# Altium project Volta-Interface.PrjPcb
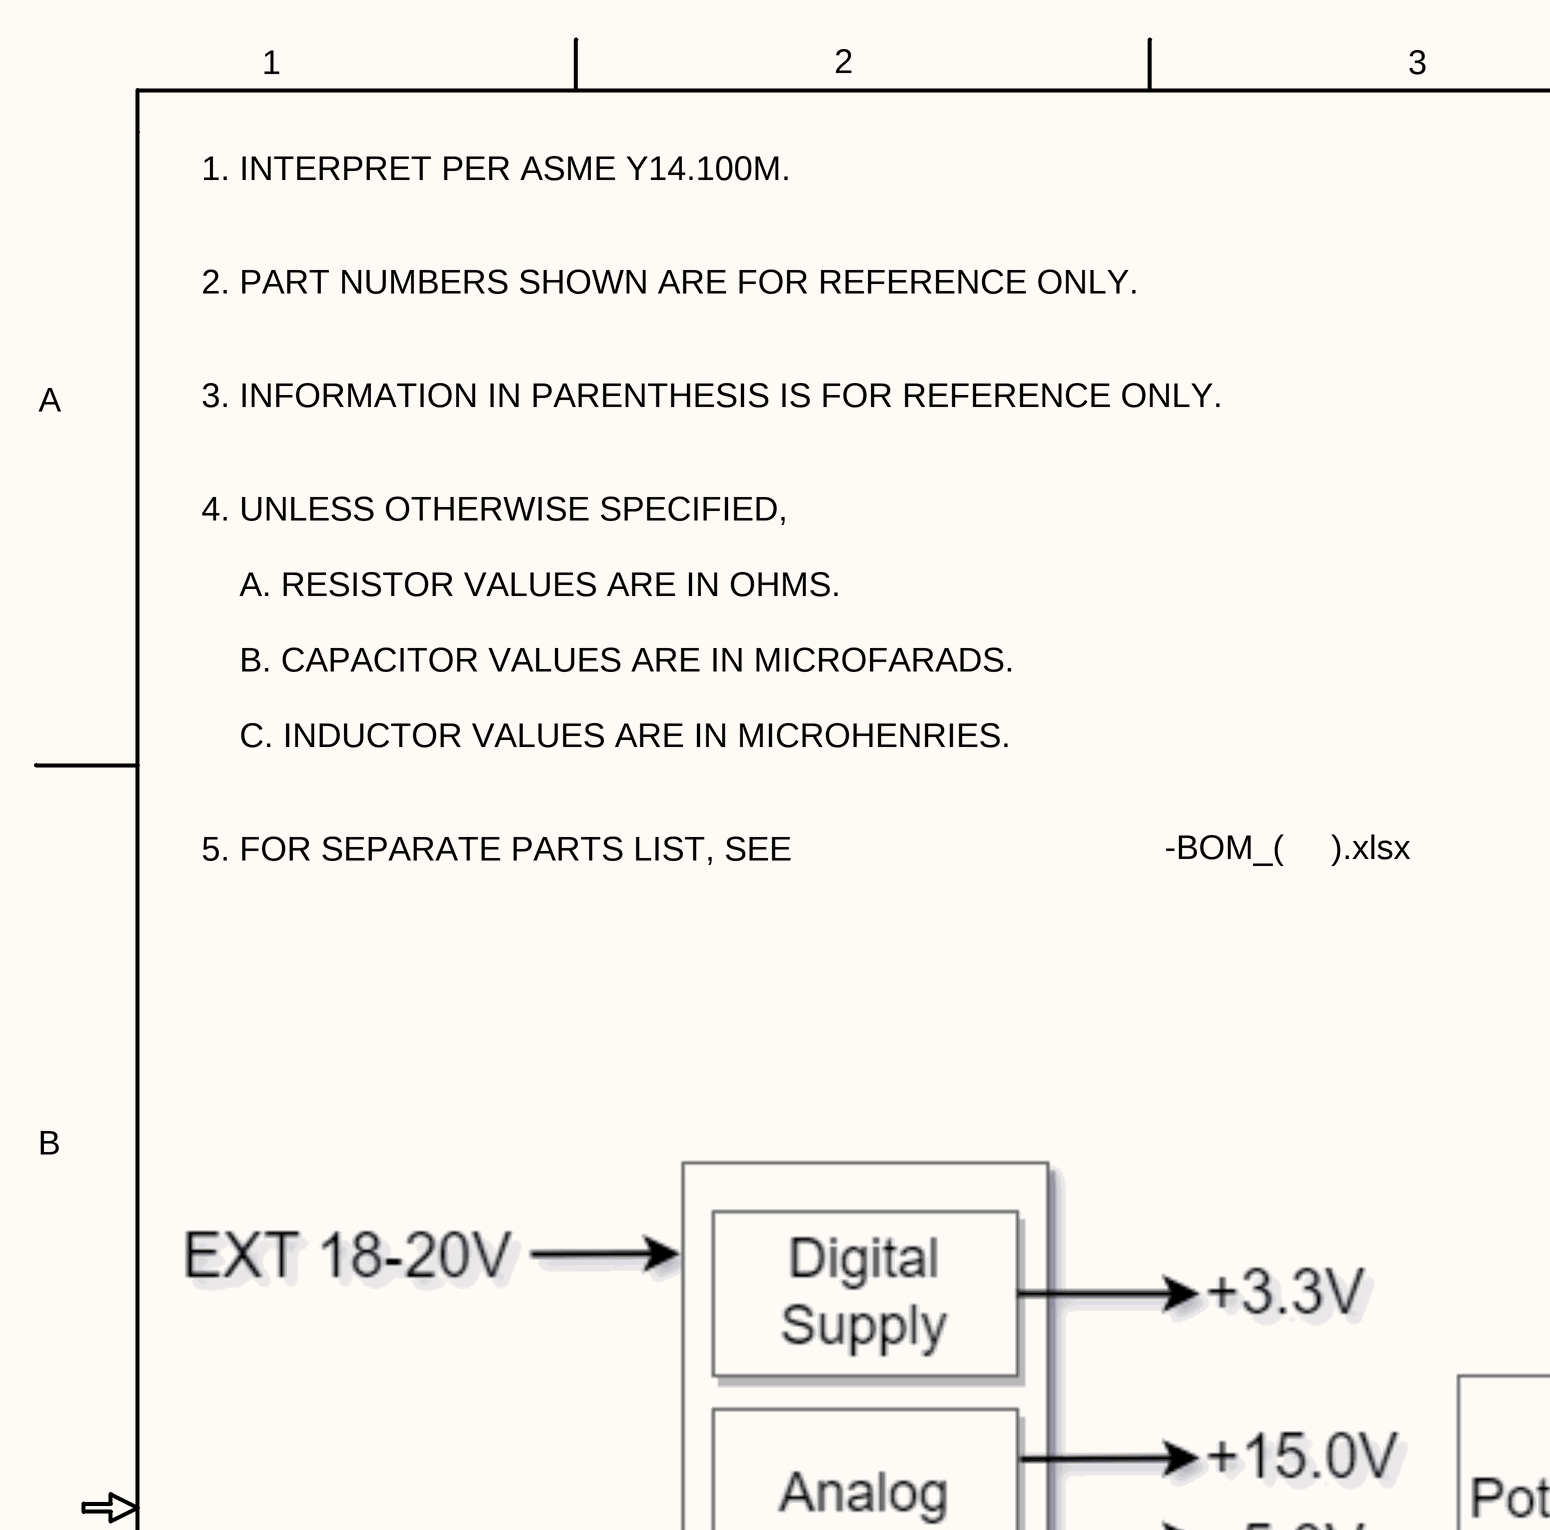
[diagram p0: Volta-Interface-SCH_SH1_(A).SchDoc, top left]
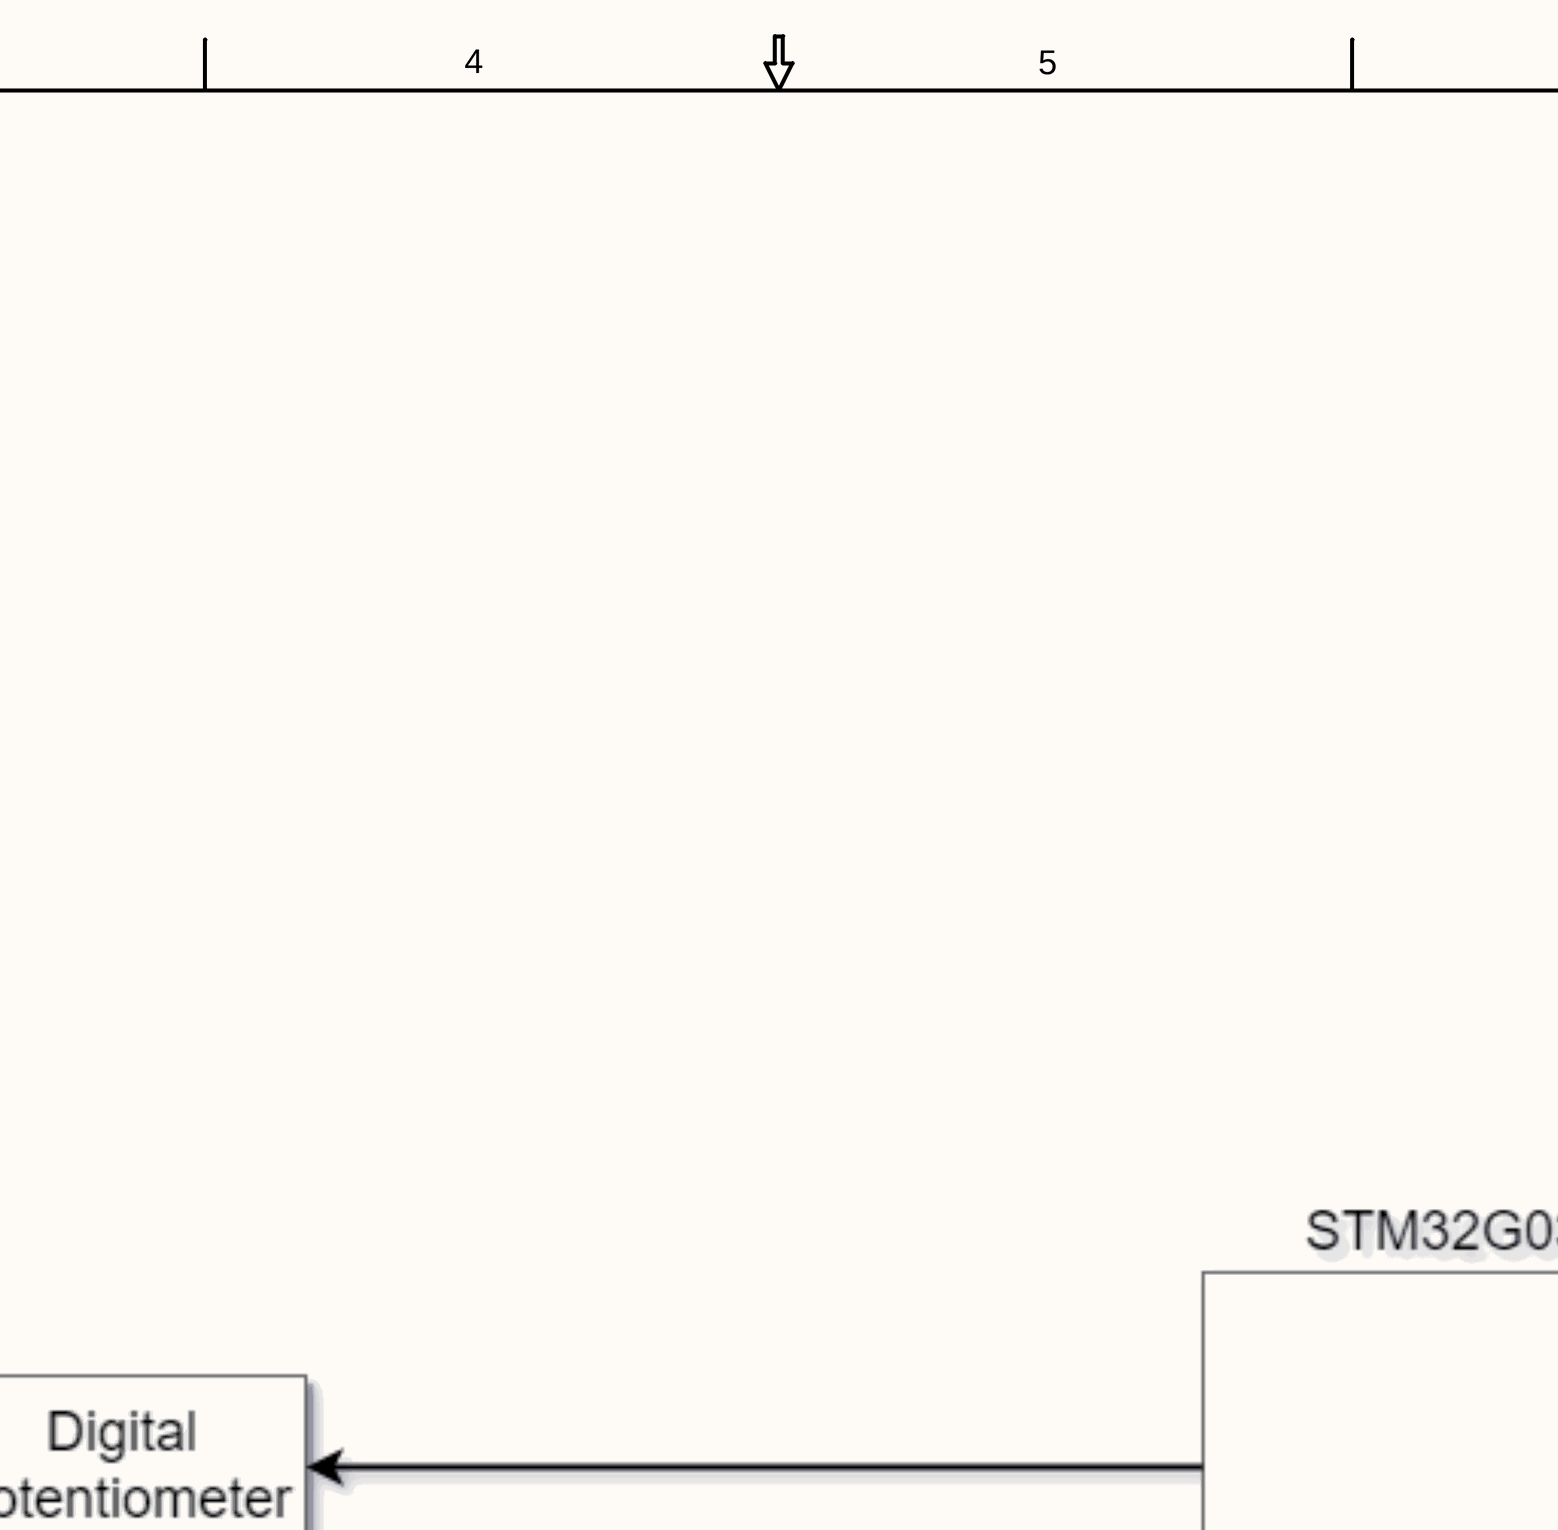
[diagram p1: Volta-Interface-SCH_SH1_(A).SchDoc, top middle]
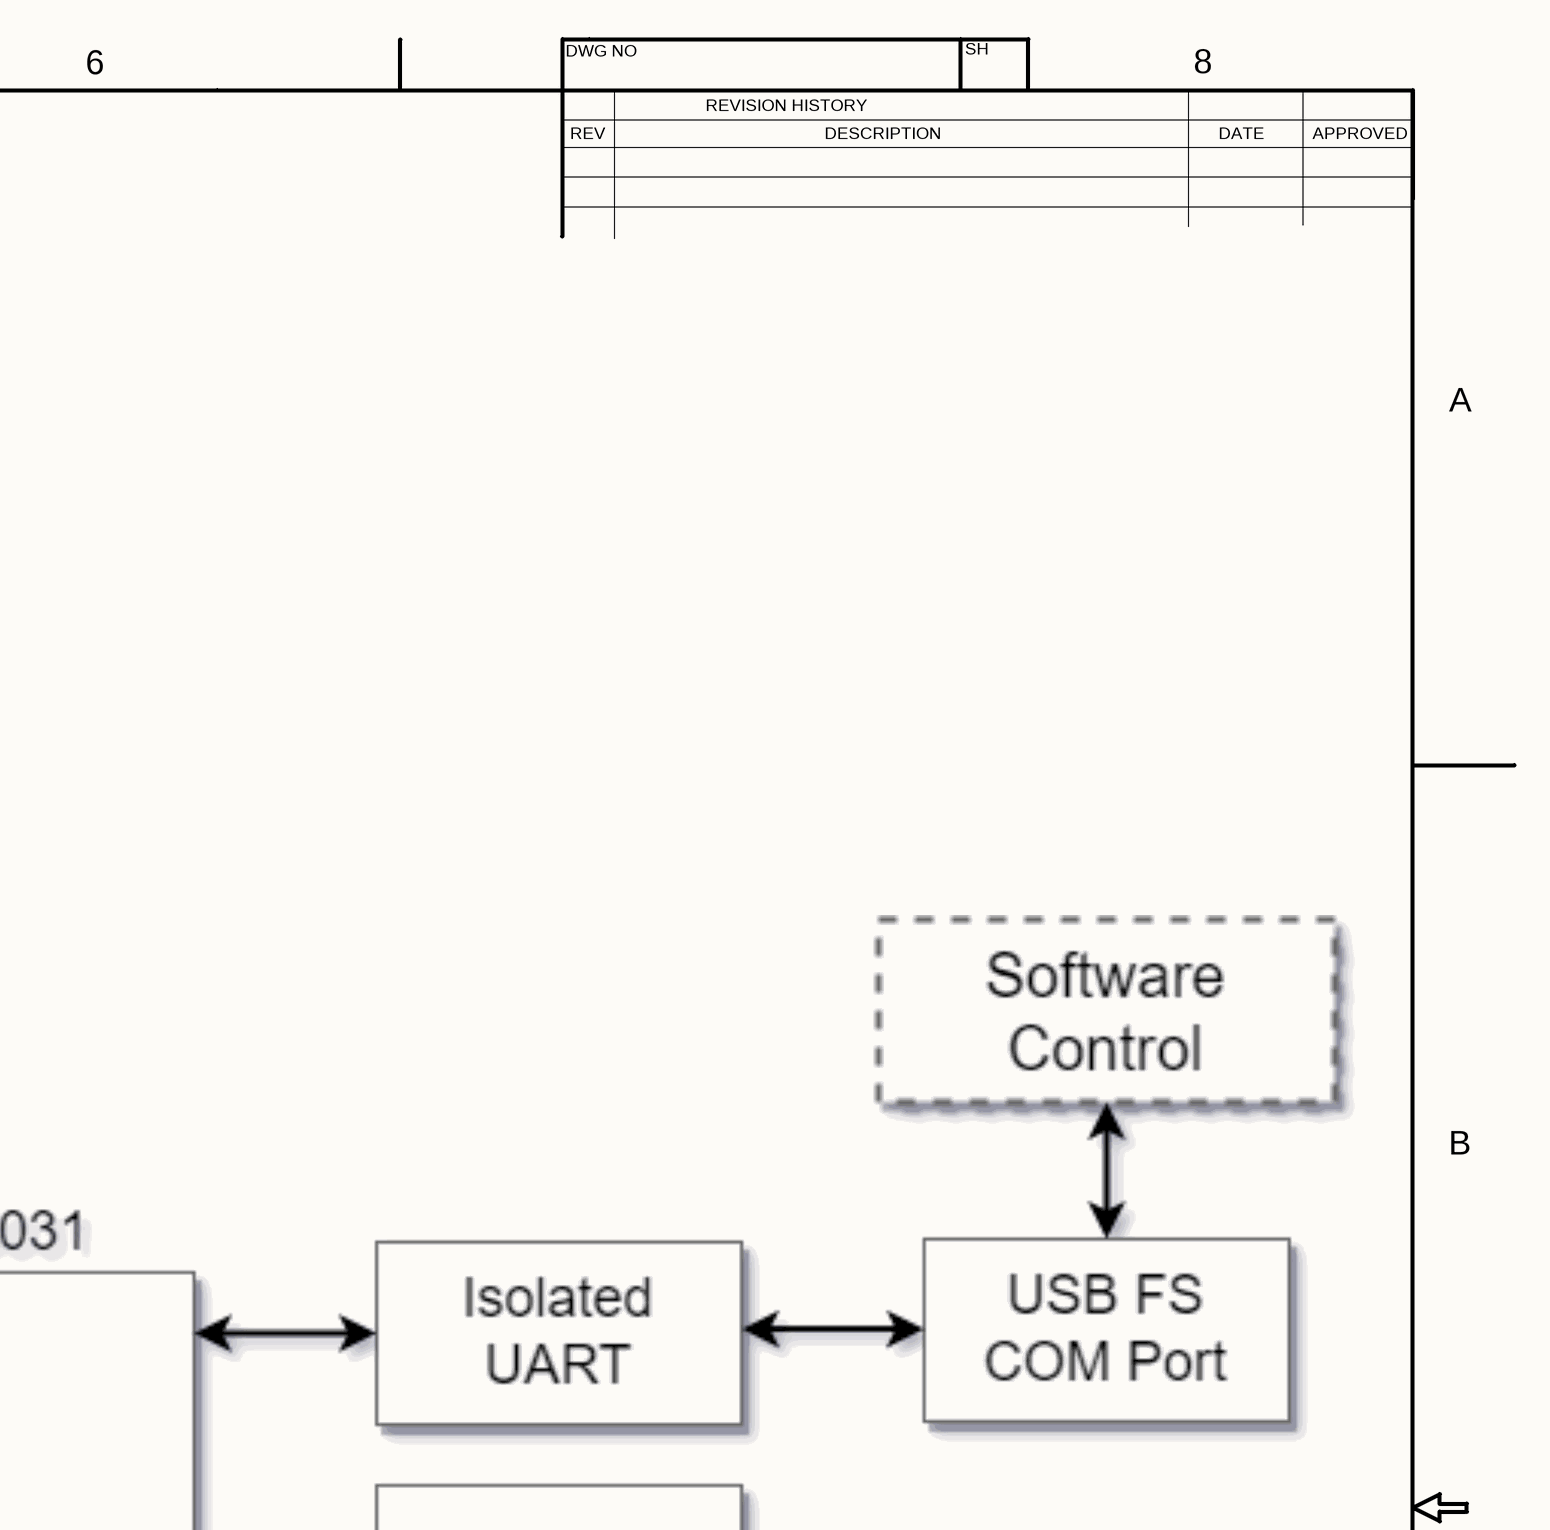
[diagram p2: Volta-Interface-SCH_SH1_(A).SchDoc, top right]
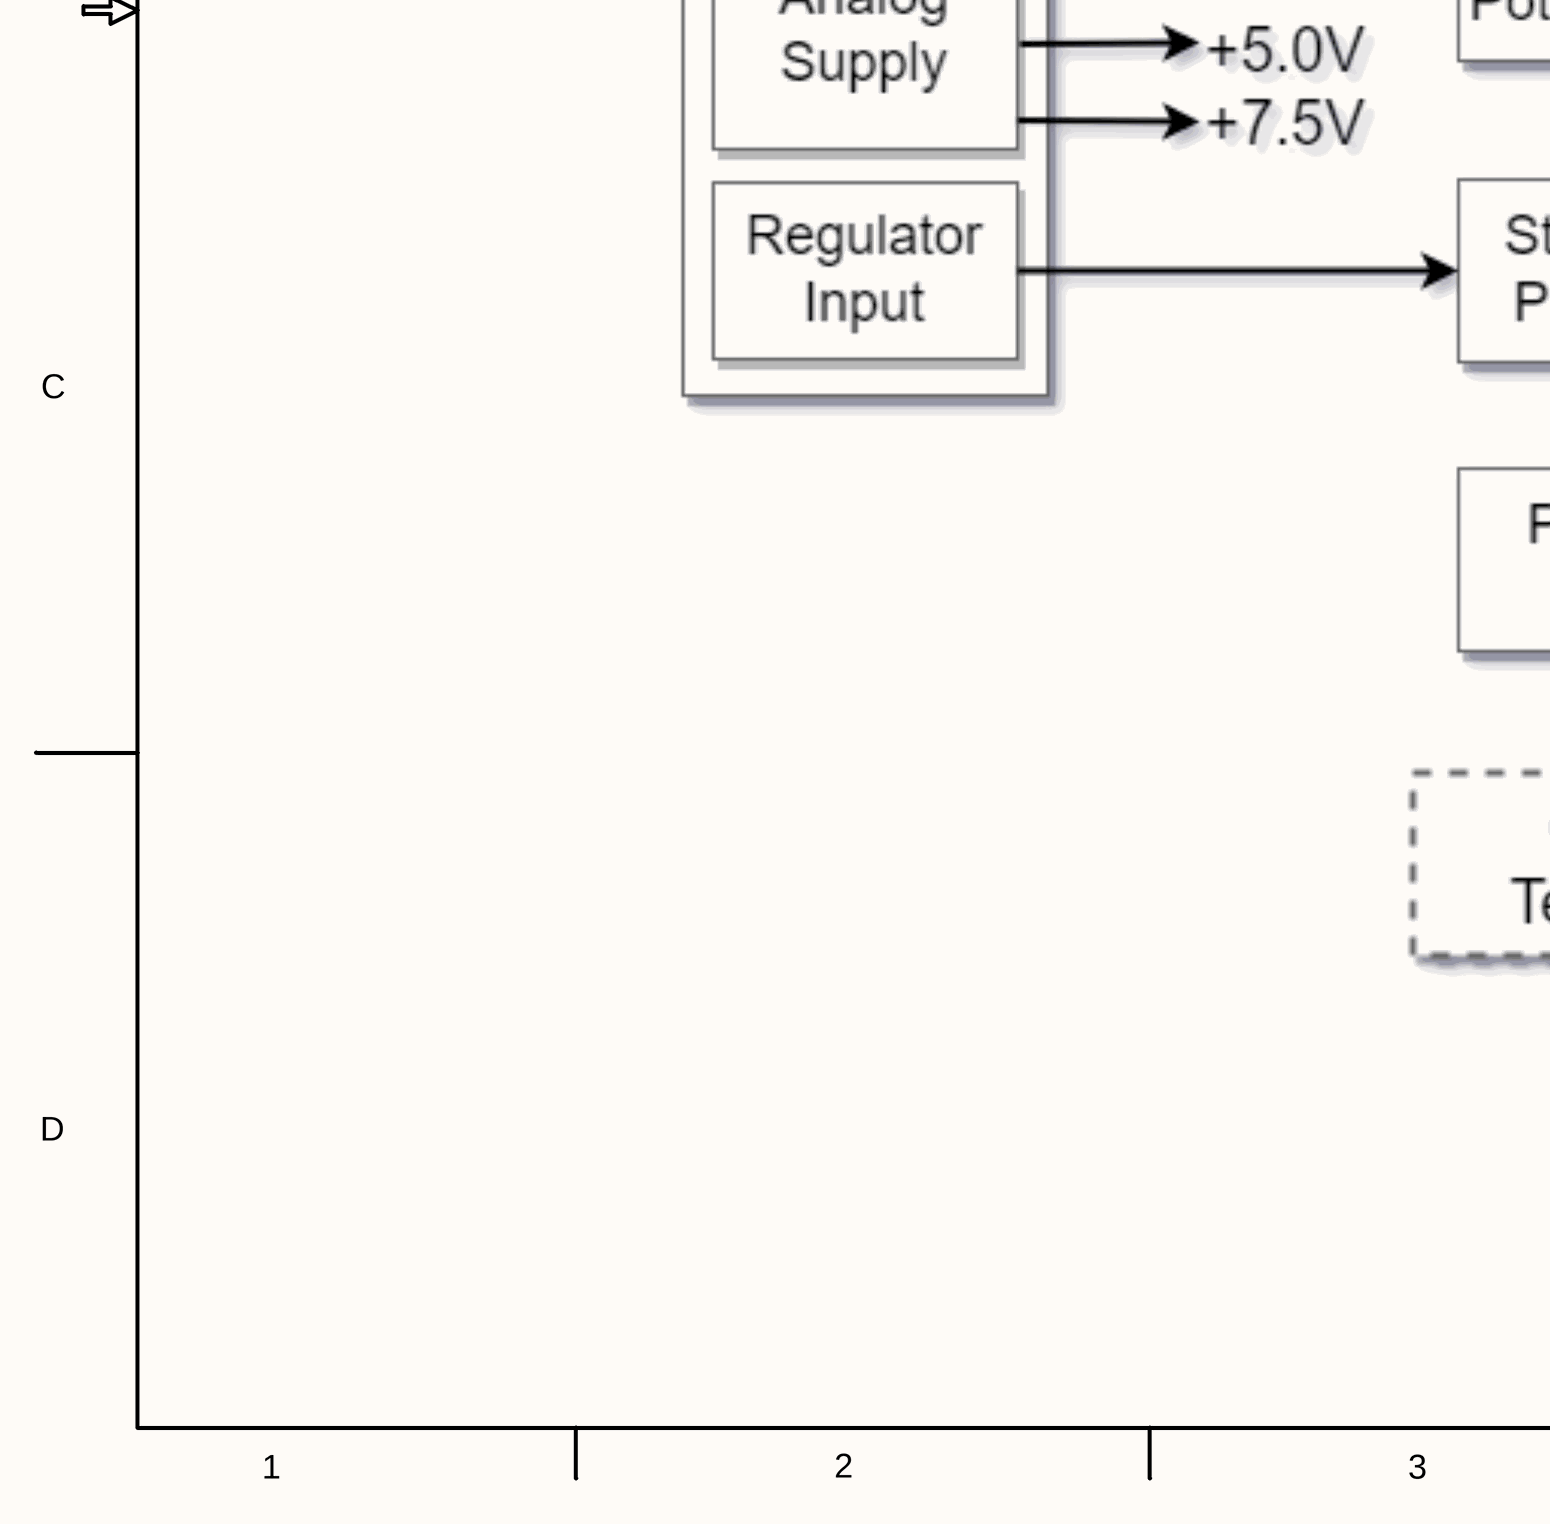
[diagram p3: Volta-Interface-SCH_SH1_(A).SchDoc, bottom left]
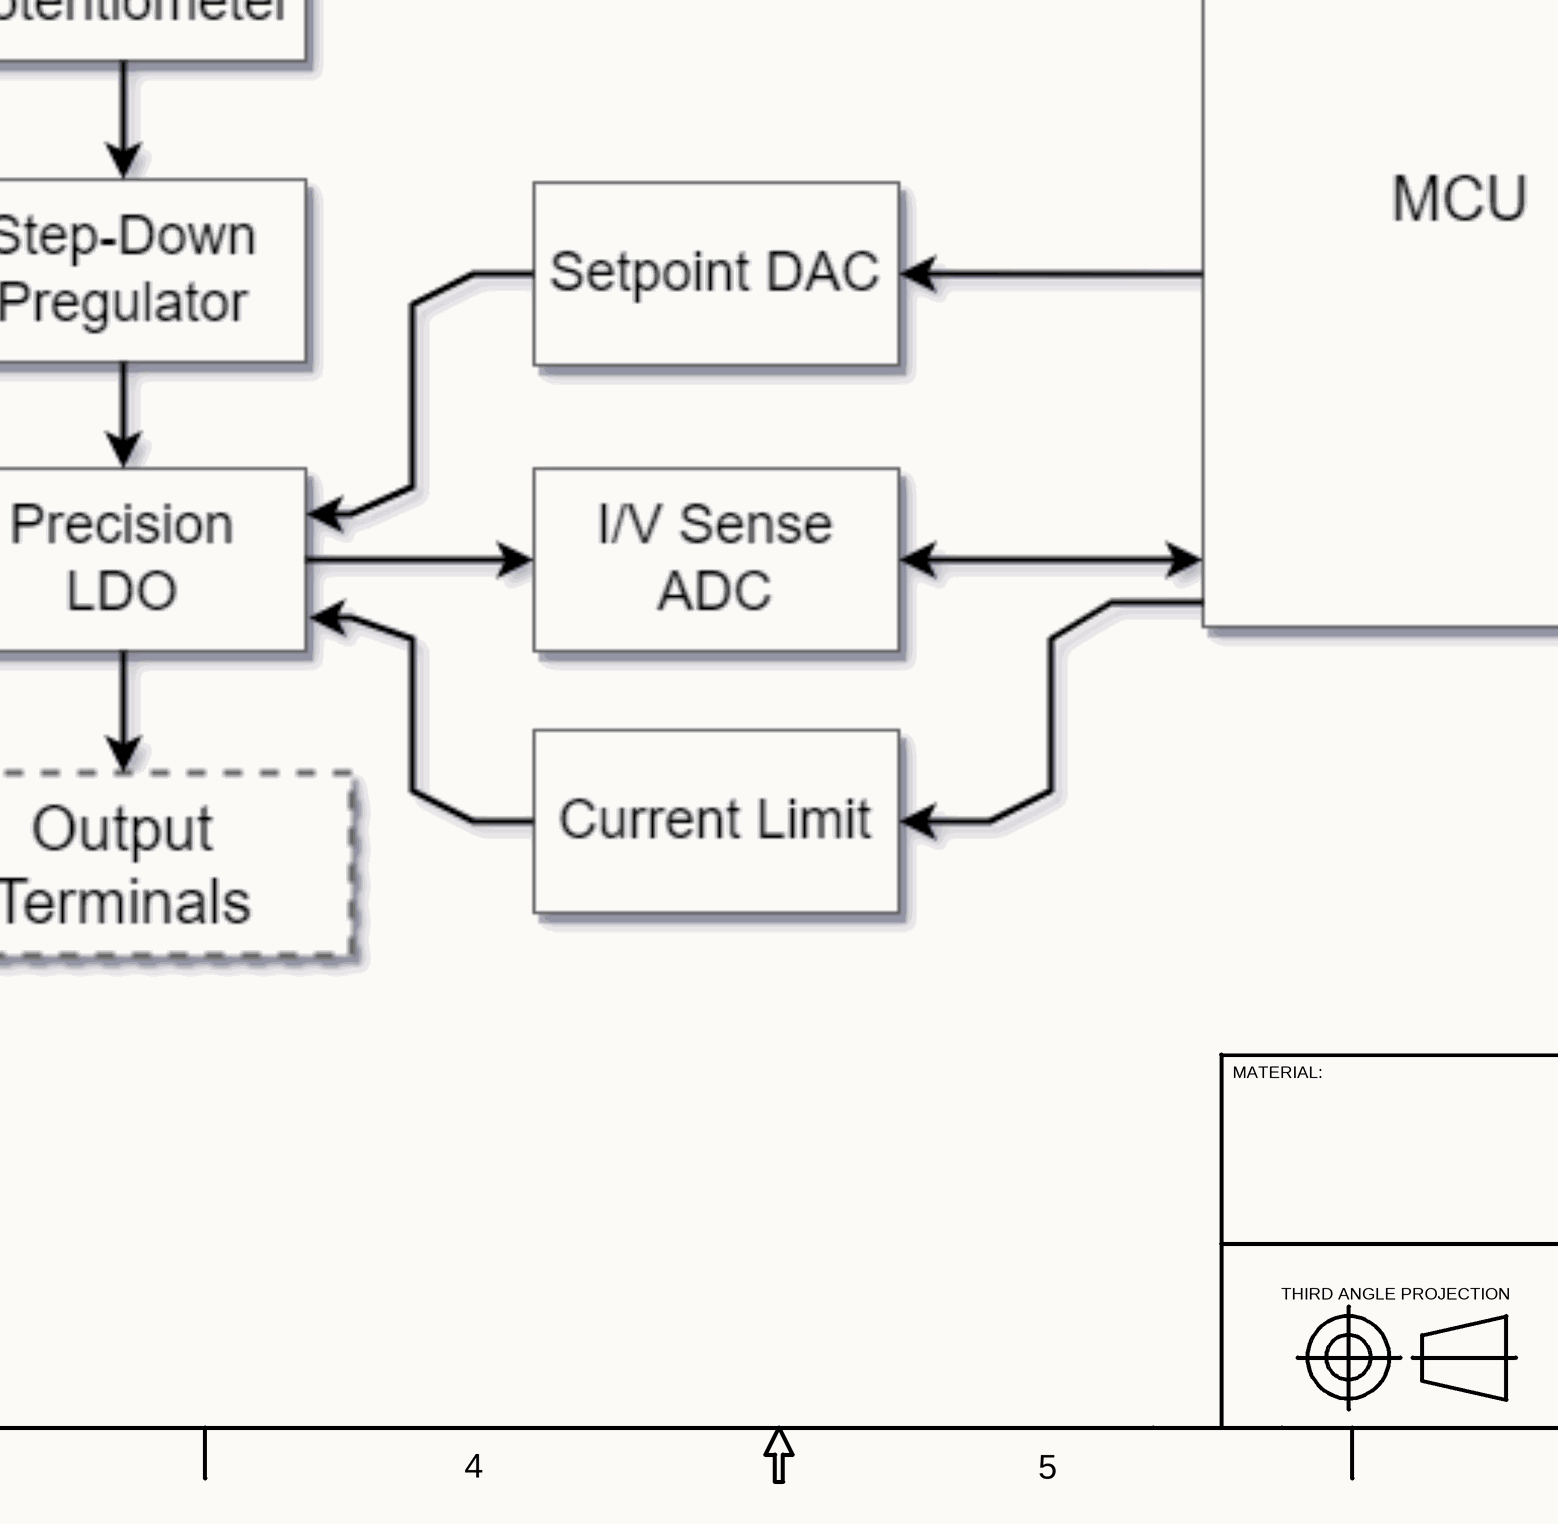
[diagram p4: Volta-Interface-SCH_SH1_(A).SchDoc, bottom middle]
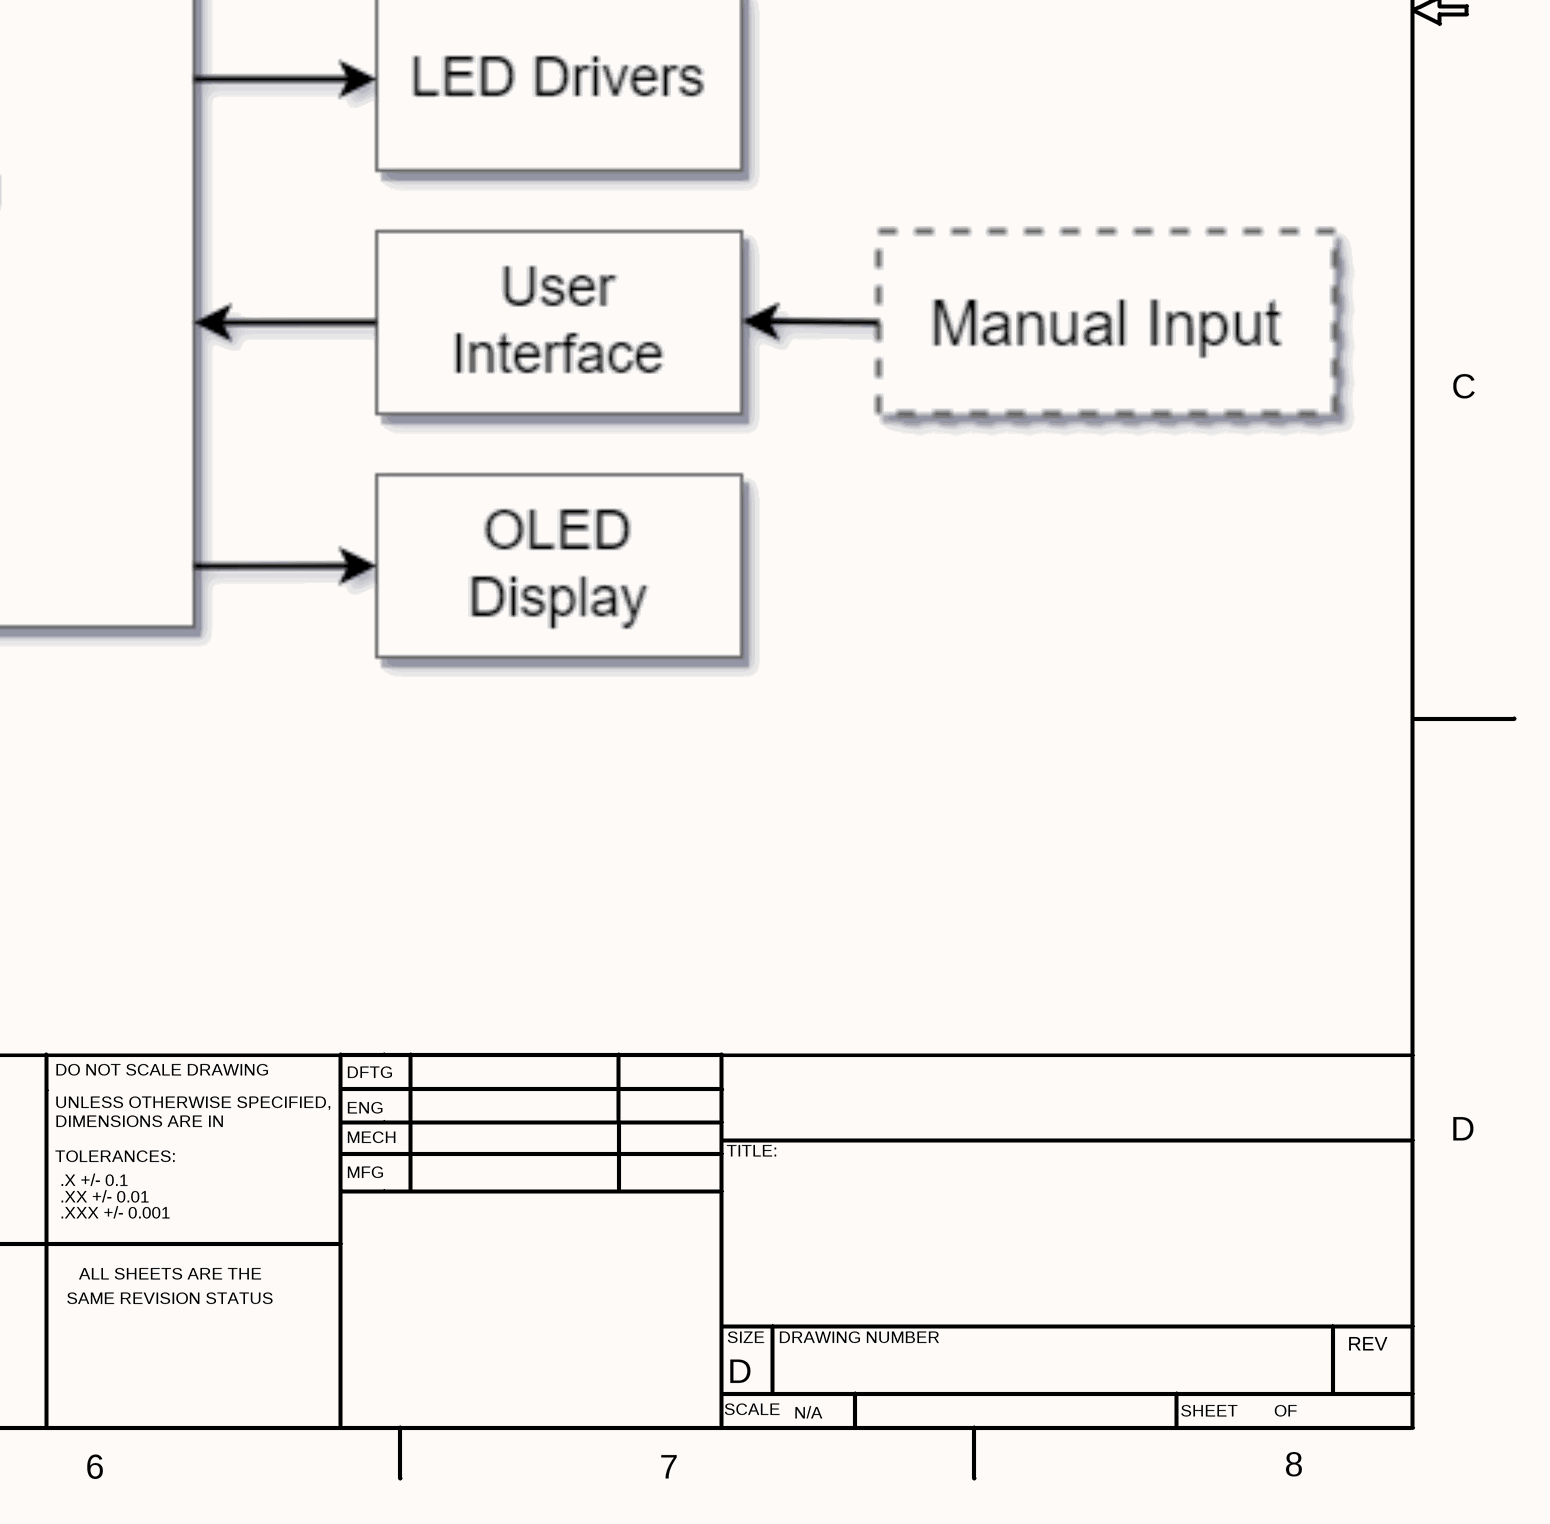
[diagram p5: Volta-Interface-SCH_SH1_(A).SchDoc, bottom right]
TitleSCH: SCHEMATIC, CCA,; TitlePCB: PRINTED CIRCUIT BOARD,; TitleCCA: CIRCUIT CARD ASSEMBLY,; Title1: Front Panel Assembly; Title0: Volta Interface; Rev: A; NameEng: K. KIDD; NameDftg: K. KIDD; Hist3Rev: A; Hist3Desc: DESIGN RELEASE; Hist3Date: 10/17/2022; Hist3Appr: -; Hist2Rev: 02; Hist2Desc: MECHANICAL FIT ADJUSTMENTS; Hist2Date: 09/17/2022; Hist2Appr: -; Hist1Rev: 01; Hist1Desc: INITIAL PROTOTYPE DESIGN; Hist1Date: 09/01/2022; Hist1Appr: -; DocNumberPCB: Volta-Inter-PCB; DocNumber: Volta-Interface; DateEng: 10/17/2022; DateDftg: 10/17/2022; Company: -
2 sheets, 63 parts. Net scope: global (net labels, ports and power ports of the same name join across sheets).
Board file: Volta-Interface.PcbDoc
Sheets:
  Volta-Interface-SCH_SH1_(A).SchDoc
  Volta-Interface-SCH_SH2_(A).SchDoc

## Sheet Volta-Interface-SCH_SH1_(A).SchDoc: SCHEMATIC, CCA,
size 863 x 558 mm; DocumentNumber: NIR-Spec-1; SheetNumber: 1; SheetTotal: 2

### Notes on the sheet
- 1
- 2
- 3
- 4
- 5
- 6
- DWG NO
- REVISION HISTORY
- SH
- 8
- REV
- DESCRIPTION
- DATE
- APPROVED
- A
- -BOM_(
- ).xlsx
- 1. INTERPRET PER ASME Y14.100M.
  2. PART NUMBERS SHOWN ARE FOR REFERENCE ONLY.
  3. INFORMATION IN PARENTHESIS IS FOR REFERENCE ONLY.
  4. UNLESS OTHERWISE SPECIFIED,
  A. RESISTOR VALUES ARE IN OHMS.
  B. CAPACITOR VALUES ARE IN MICROFARADS.
  C. INDUCTOR VALUES ARE IN MICROHENRIES.
  5. FOR SEPARATE PARTS LIST, SEE
- B
- C
- MATERIAL:
- DO NOT SCALE DRAWING
- UNLESS OTHERWISE SPECIFIED,
- ENG
- DFTG
- D
- DIMENSIONS ARE IN
- TOLERANCES:
- MECH
- MFG
- TITLE:
- .X +/- 0.1
- .XX +/- 0.01
- .XXX +/- 0.001
- THIRD ANGLE PROJECTION
- SAME REVISION STATUS
- ALL SHEETS ARE THE
- SIZE
- DRAWING NUMBER
- SCALE
- N/A
- SHEET        OF
- 7

## Sheet Volta-Interface-SCH_SH2_(A).SchDoc: SCHEMATIC
size 863 x 558 mm; DocumentNumber: NIR-Spec-2; SheetNumber: 2; SheetTotal: 2; PageSetup: Record=PageOptions|CenterHorizontal=True|CenterVertical=True|PrintScale=0.98|XCorrection=1.00|YCorrection=1.00|PrintKind=2|BorderSize=5000000|LeftOffset=0|BottomOffset=0|Orientation=2|PaperLength=1000|PaperWidth=1000|Scale=100|PaperSource=15|PrintQuality=1200|MediaType=1|DitherType=10|PaperKind=11 x 17|PrintScaleMode=1
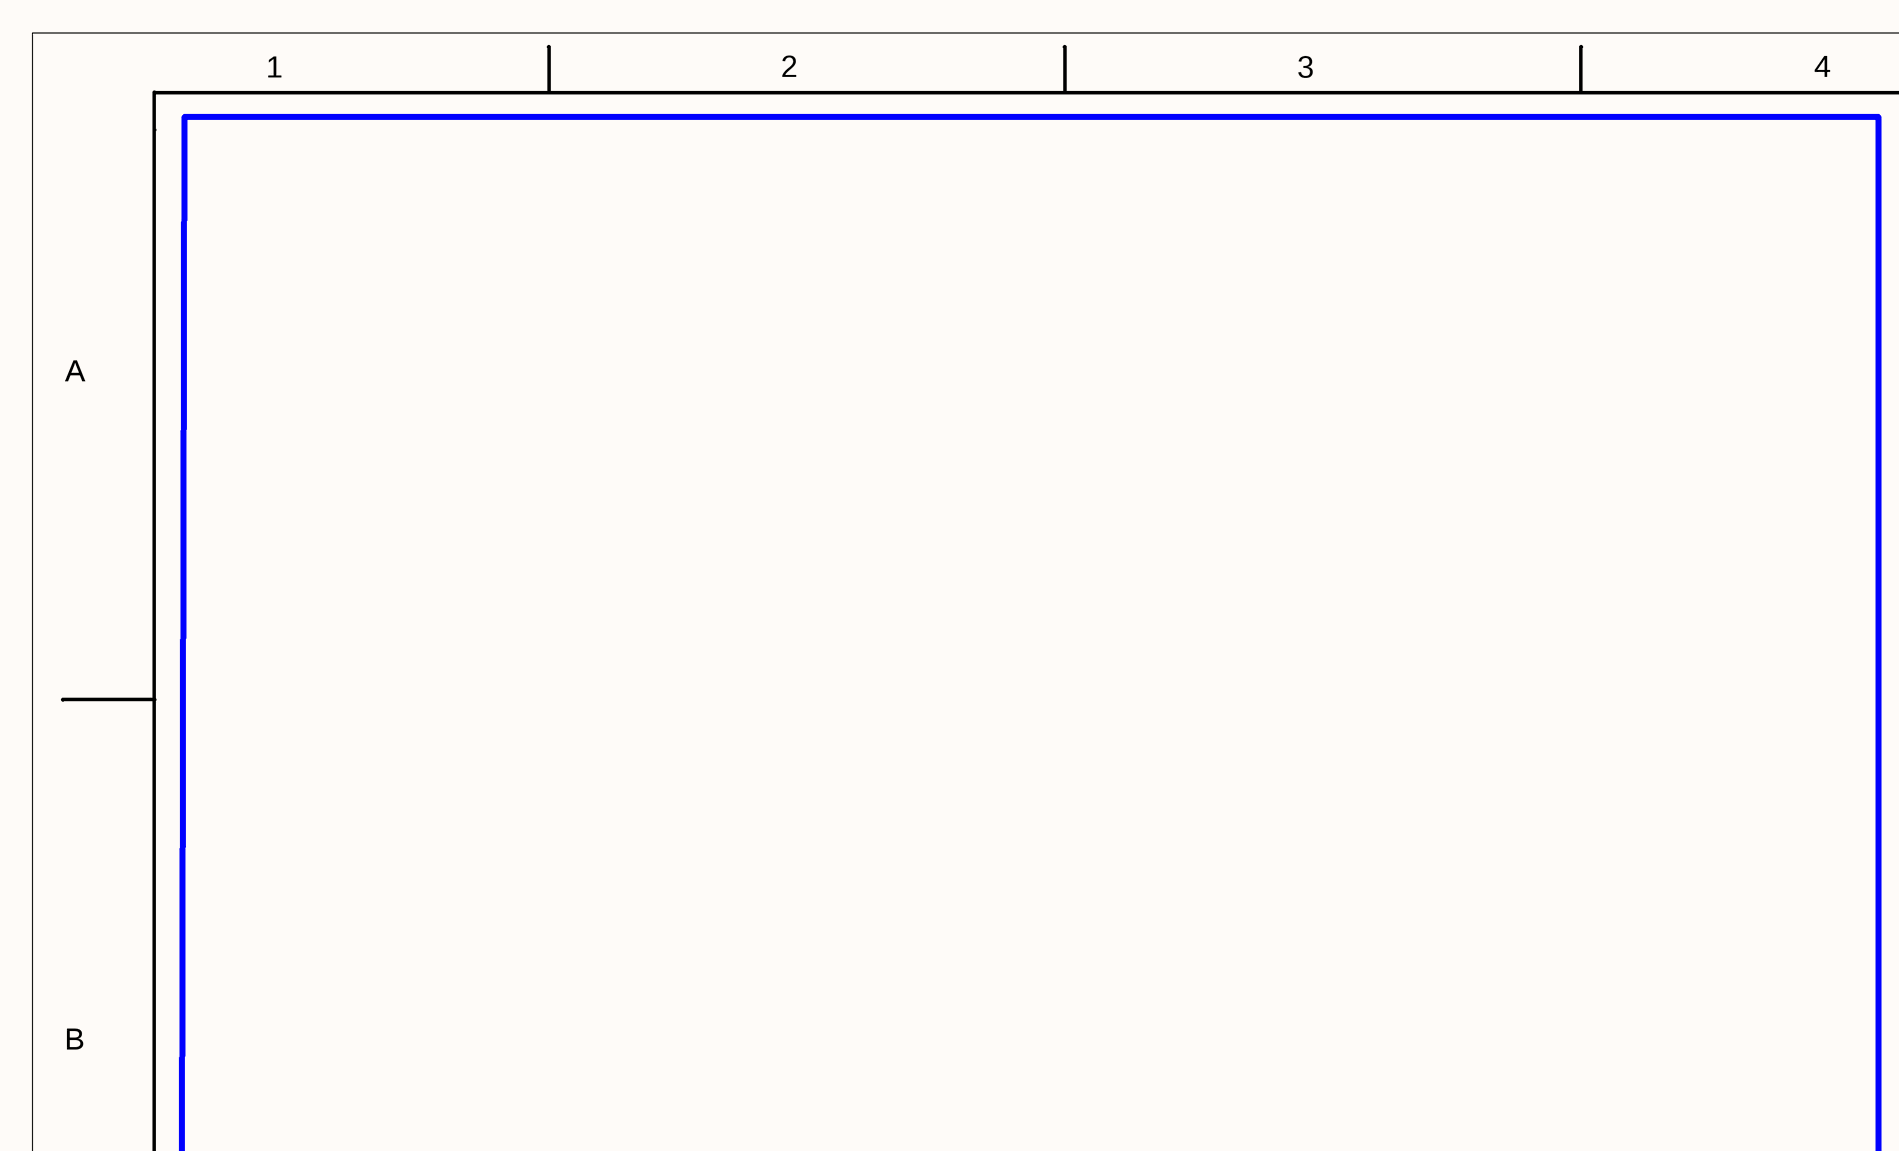
[diagram p6: Volta-Interface-SCH_SH2_(A).SchDoc, top left]
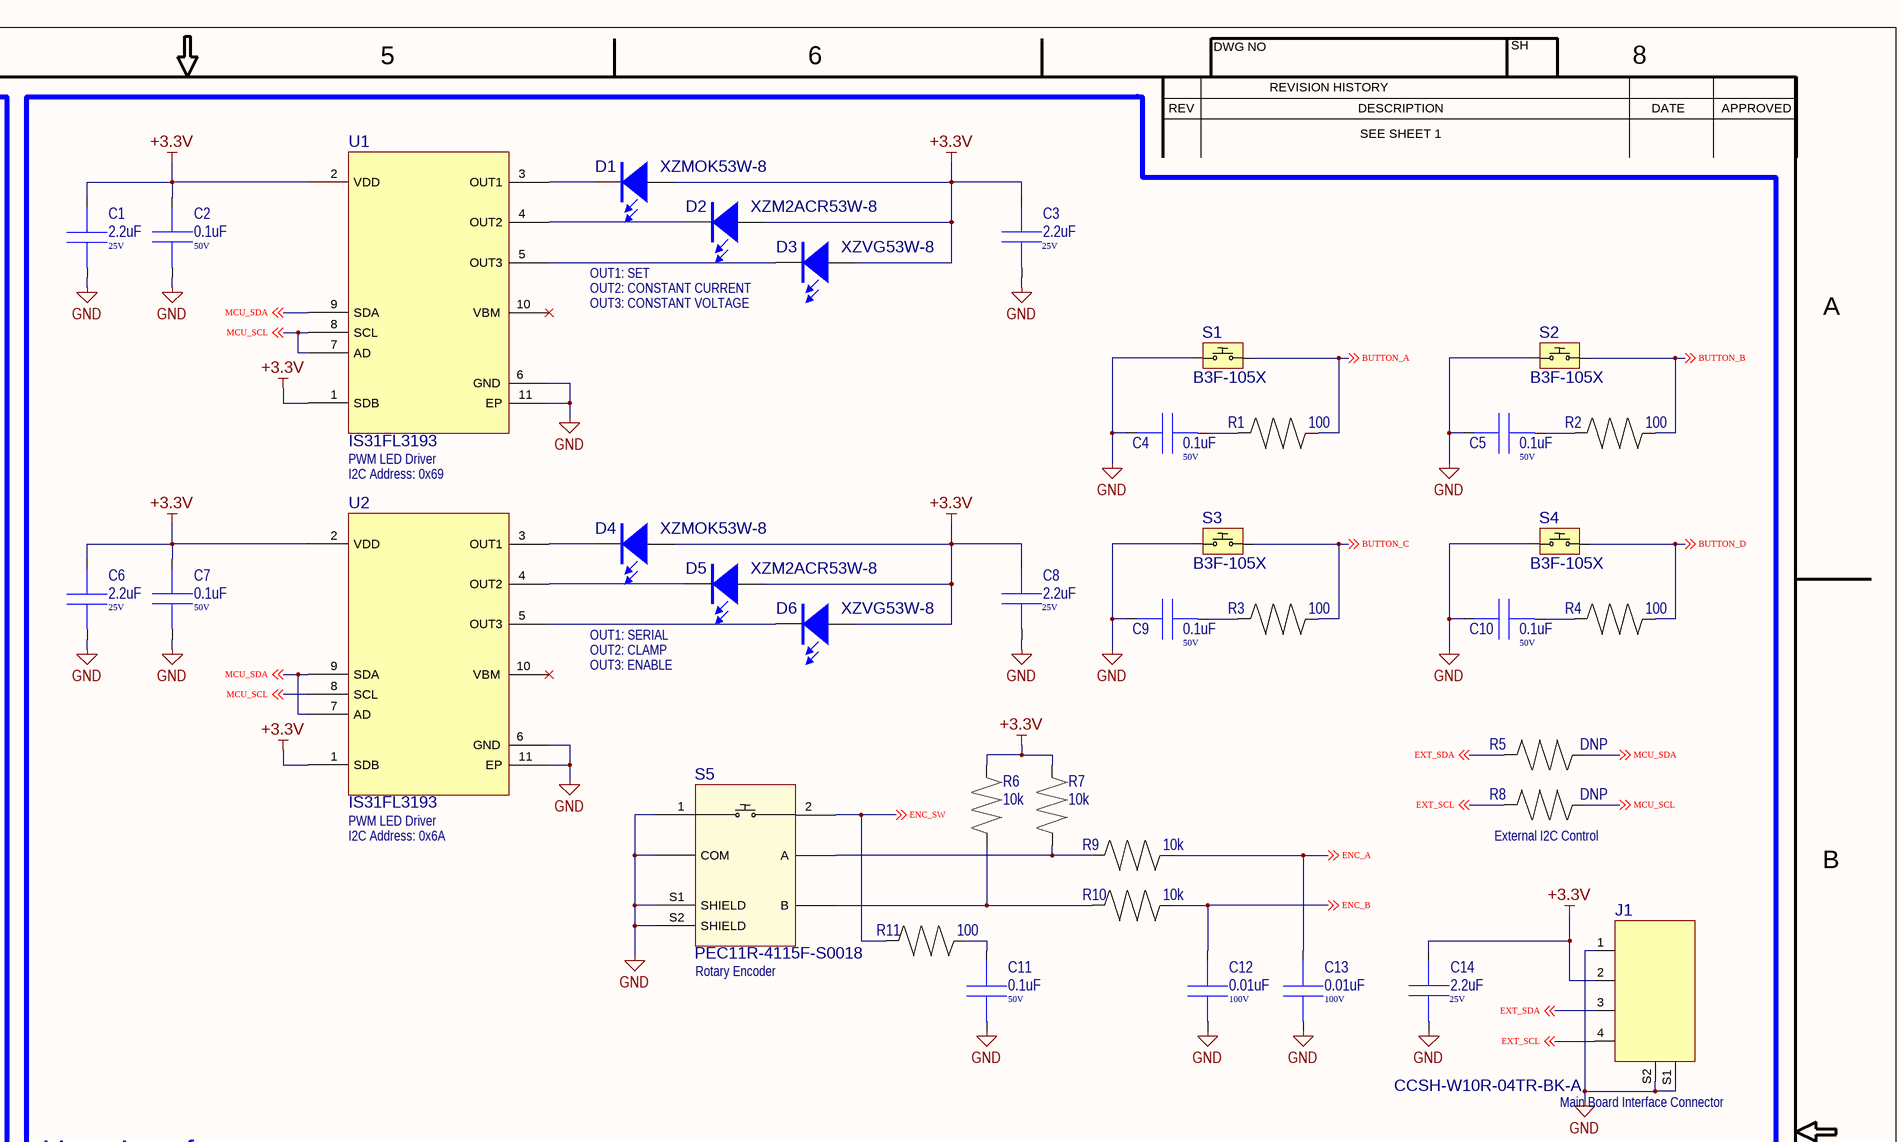
[diagram p7: Volta-Interface-SCH_SH2_(A).SchDoc, top right]
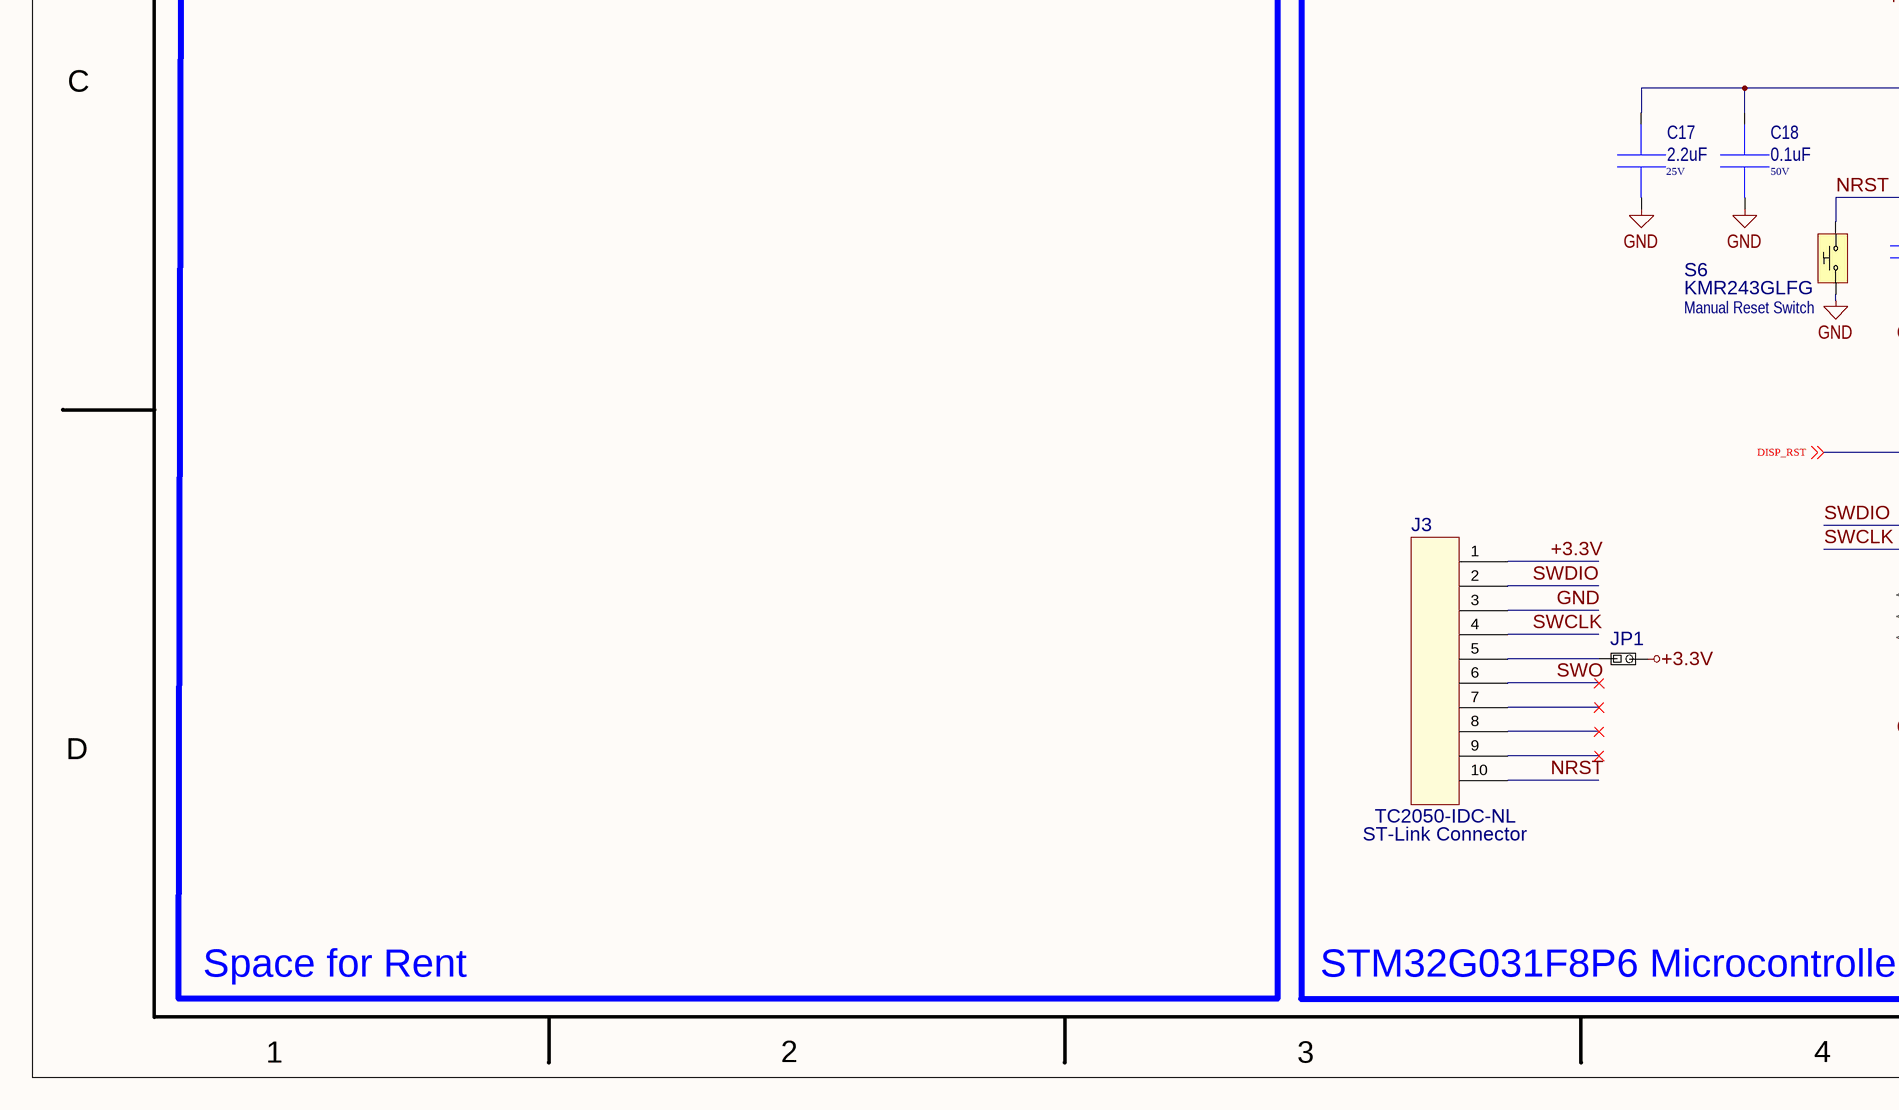
[diagram p8: Volta-Interface-SCH_SH2_(A).SchDoc, bottom left]
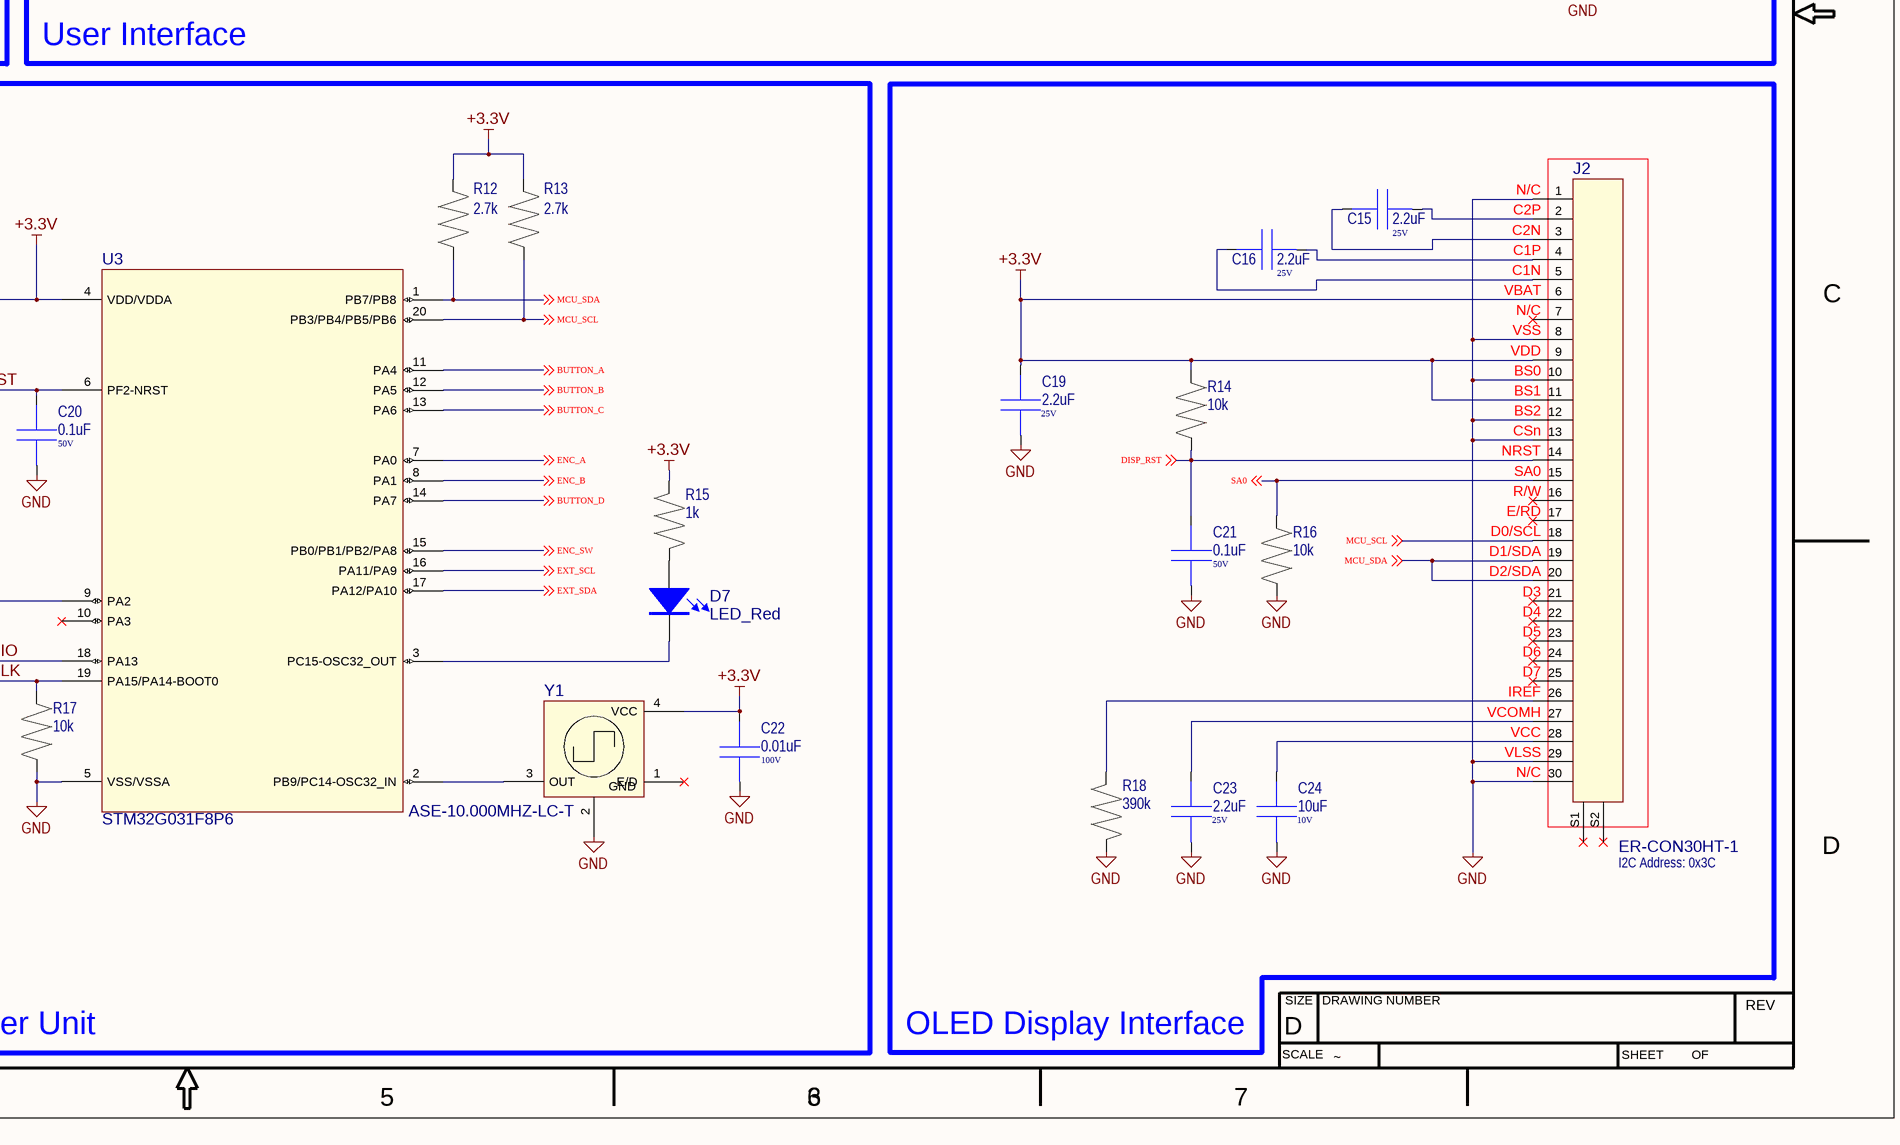
[diagram p9: Volta-Interface-SCH_SH2_(A).SchDoc, bottom right]

### Parts
C1  2.2uF  Voltage: 25V  [0402]
C2  0.1uF  Voltage: 50V  [0402]
C3  2.2uF  Voltage: 25V  [0402]
C4  0.1uF  Voltage: 50V  [0402]
C5  0.1uF  Voltage: 50V  [0402]
C6  2.2uF  Voltage: 25V  [0402]
C7  0.1uF  Voltage: 50V  [0402]
C8  2.2uF  Voltage: 25V  [0402]
C9  0.1uF  Voltage: 50V  [0402]
C10  0.1uF  Voltage: 50V  [0402]
C11  0.1uF  Voltage: 50V  [0402]
C12  0.01uF  Voltage: 100V  [0402]
C13  0.01uF  Voltage: 100V  [0402]
C14  2.2uF  Voltage: 25V  [0402]
C15  2.2uF  Voltage: 25V  [0402]
C16  2.2uF  Voltage: 25V  [0402]
C17  2.2uF  Voltage: 25V  [0402]
C18  0.1uF  Voltage: 50V  [0402]
C19  2.2uF  Voltage: 25V  [0402]
C20  0.1uF  Voltage: 50V  [0402]
C21  0.1uF  Voltage: 50V  [0402]
C22  0.01uF  Voltage: 100V  [0402]
C23  2.2uF  Voltage: 25V  [0402]
C24  10uF  Voltage: 10V  [0402]
D1  XZMOK53W-8  [0603_LED_DOME]
D2  XZM2ACR53W-8  [0603_LED_DOME]
D3  XZVG53W-8  [0603_LED_DOME]
D4  XZMOK53W-8  [0603_LED_DOME]
D5  XZM2ACR53W-8  [0603_LED_DOME]
D6  XZVG53W-8  [0603_LED_DOME]
D7  LED_Red  [0603_LED_Red]
J1  CCSH-W10R-04TR-BK-A  [CCSH-W10R-04TR-BK-A]
J2  ER-CON30HT-1  [ER-CON30HT-1]
J3  TC2050-IDC-NL  [TC2050-IDC-NL-FP]  (no BOM)
JP1  Solder Jumper  [SOLDER JUMPER]  (value not drawn)  (no BOM)
R1  100  [0402]
R2  100  [0402]
R3  100  [0402]
R4  100  [0402]
R5  DNP  [0402]
R6  10k  [0402]
R7  10k  [0402]
R8  DNP  [0402]
R9  10k  [0402]
R10  10k  [0402]
R11  100  [0402]
R12  2.7k  [0402]
R13  2.7k  [0402]
R14  10k  [0402]
R15  1k  [0402]
R16  10k  [0402]
R17  10k  [0402]
R18  390k  [0402]
S1  B3F-105X  [B3F-105X]
S2  B3F-105X  [B3F-105X]
S3  B3F-105X  [B3F-105X]
S4  B3F-105X  [B3F-105X]
S5  PEC11R-4115F-S0018  [PEC11R-4xxxF-Sxxxx]
S6  KMR243GLFG  [KMR 2 Series]
U1  IS31FL3193  [DFN-10]
U2  IS31FL3193  [DFN-10]
U3  STM32G031F8P6  [TSSOP-20]
Y1  ASE-10.000MHZ-LC-T  [ASE-XXXXX-X-X-X]

### Blocks framed on the sheet
User Interface: C1-C14 D1-D6 J1 R1-R11 S1-S5 U1 U2
STM32G031F8P6 Microcontroller Unit: C17 C18 C20 C22 D7 J3 JP1 R12 R13 R15 R17 S6 U3 Y1
OLED Display Interface: C15 C16 C19 C21 C23 C24 J2 R14 R16 R18

### Nets
+3.3V: C1.2 C2.2 C3.2 C6.2 C7.2 C8.2 C14.2 C17.2 C18.2 C19.2 C22.2 D1.1(A) D2.1(A) D3.1(A) D4.1(A) D5.1(A) D6.1(A) J1.2 J2.6 J2.9 J2.11 J3.1 JP1.2 R6.1 R7.1 R12.2 R13.2 R14.1 R15.2 U1.1(SDB) U1.2(VDD) U2.1(SDB) U2.2(VDD) U3.4(VDD/VDDA) Y1.4(VCC)
GND: C1.1 C2.1 C3.1 C4.2 C5.2 C6.1 C7.1 C8.1 C9.2 C10.2 C11.1 C12.1 C13.1 C14.1 C17.1 C18.1 C19.1 C20.1 C21.1 C22.1 C23.1 C24.1 J1.1 J1.S1 J1.S2 J2.1 J2.8 J2.10 J2.12 J2.13 J2.29 J2.30 J3.3 R16.2 R17.2 R18.1 S1.1 S2.1 S3.1 S4.1 S5.1 S5.COM S5.S1(SHIELD) S5.S2(SHIELD) S6.1 U1.6(GND) U1.11(EP) U2.6(GND) U2.11(EP) U3.5(VSS/VSSA) Y1.2(GND)
BUTTON_A: R1.2 S1.2 U3.11(PA4) ; off-sheet BUTTON_A
BUTTON_B: R2.2 S2.2 U3.12(PA5) ; off-sheet BUTTON_B
BUTTON_C: R3.2 S3.2 U3.13(PA6) ; off-sheet BUTTON_C
BUTTON_D: R4.2 S4.2 U3.14(PA7) ; off-sheet BUTTON_D
DISP_RST: C21.2 J2.14 R14.2 U3.9(PA2) ; off-sheet DISP_RST
ENC_A: C13.2 R9.2 U3.7(PA0) ; off-sheet ENC_A
ENC_B: C12.2 R10.2 U3.8(PA1) ; off-sheet ENC_B
ENC_SW: R11.1 S5.2 U3.15(PB0/PB1/PB2/PA8) ; off-sheet ENC_SW
EXT_SCL: J1.4 R8.2 U3.16(PA11/PA9) ; off-sheet EXT_SCL
EXT_SDA: J1.3 R5.2 U3.17(PA12/PA10) ; off-sheet EXT_SDA
MCU_SCL: J2.18 R8.1 R13.1 U1.7(AD) U1.8(SCL) U2.8(SCL) U3.20(PB3/PB4/PB5/PB6) ; off-sheet MCU_SCL
MCU_SDA: J2.19 J2.20 R5.1 R12.1 U1.9(SDA) U2.7(AD) U2.9(SDA) U3.1(PB7/PB8) ; off-sheet MCU_SDA
NRST: C20.2 J3.10 S6.2 U3.6(PF2-NRST)
SA0: J2.15 R16.1 ; off-sheet SA0
SWCLK: J3.4 R17.1 U3.19(PA15/PA14-BOOT0)
SWDIO: J3.2 U3.18(PA13)
SWO: J3.6
NetC4_1: C4.1 R1.1
NetC5_1: C5.1 R2.1
NetC9_1: C9.1 R3.1
NetC10_1: C10.1 R4.1
NetC11_2: C11.2 R11.2
NetC15_1: C15.1 J2.2
NetC15_2: C15.2 J2.3
NetC16_1: C16.1 J2.4
NetC16_2: C16.2 J2.5
NetC23_2: C23.2 J2.27
NetC24_2: C24.2 J2.28
NetD1_2: D1.2(K) U1.3(OUT1)
NetD2_2: D2.2(K) U1.4(OUT2)
NetD3_2: D3.2(K) U1.5(OUT3)
NetD4_2: D4.2(K) U2.3(OUT1)
NetD5_2: D5.2(K) U2.4(OUT2)
NetD6_2: D6.2(K) U2.5(OUT3)
NetD7_1: D7.1(A) R15.1
NetD7_2: D7.2(K) U3.3(PC15-OSC32_OUT)
NetJ2_26: J2.26 R18.2
NetJ3_5: J3.5 JP1.1
NetR6_2: R6.2 R10.1 S5.B
NetR7_2: R7.2 R9.1 S5.A
NetU3_2: U3.2(PB9/PC14-OSC32_IN) Y1.3(OUT)

Not connected (* = marked no-connect by the designer): J2 7* 16* 17* 21* 22* 23* 24* 25* S1* S2*; J3 7* 8* 9*; U1 10(VBM)*; U2 10(VBM)*; U3 10(PA3)*; Y1 1(E/D)*

### Notes on the sheet
- 1
- 2
- 3
- 4
- 5
- 6
- DWG NO
- REVISION HISTORY
- SH
- 8
- REV
- DESCRIPTION
- SEE SHEET 1
- DATE
- APPROVED
- OUT1: SET
- OUT2: CONSTANT CURRENT
- A
- OUT3: CONSTANT VOLTAGE
- I2C Address: 0x69
- PWM LED Driver
- OUT1: SERIAL
- OUT2: CLAMP
- OUT3: ENABLE
- I2C Address: 0x6A
- (near R8) External I2C Control
- B
- (near S5) Rotary Encoder
- Main Board Interface Connector
- (near J2) N/C
- (near J2) C2P
- (near J2) C2N
- (near J2) C1P
- (near J2) C1N
- C
- (near J2) VBAT
- (near J2) VSS
- (near J2) VDD
- (near J2) BS0
- (near J2) BS1
- (near J2) BS2
- (near J2) CSn
- (near J2) NRST
- (near J2) SA0
- (near S6) Manual Reset Switch
- (near J2) R/W
- (near J2) E/RD
- (near J2) D0/SCL
- (near J2) D1/SDA
- (near J2) D2/SDA
- (near J2) D3
- (near J2) D4
- (near J2) D5
- (near J2) D6
- (near J2) D7
- (near J2) IREF
- (near J2) VCOMH
- (near J2) VCC
- (near J2) VLSS
- D
- I2C Address: 0x3C
- (near J3) ST-Link Connector
- Space for Rent
- SIZE
- DRAWING NUMBER
- SCALE
- ~
- SHEET        OF
- 7

### Library data of the parts
C1 C3 C6 C8 C14-C17 C19 C23 = CAP: CAP CER 2.2UF 25V X5R 0402; Part Number: GRM155R61E225KE11D; Manufacturer: Murata Electronics; ClassName: Interface
C2 C7 C18 C20 C21 = CAP: CAP CER 0.1UF 50V X7R 0402; Part Number: UMK105B7104KVHF; Manufacturer: Taiyo Yuden; ClassName: Interface
C4 C5 C9-C11 = CAP: CAP CER 0.1UF 50V X7R 0402; Part Number: GRM155R61E225KE11D; Manufacturer: Taiyo Yuden; ClassName: Interface
C12 C13 C22 = CAP: CAP CER 0.01UF 100V X7R 0402; Part Number: HMR105B7103MV-F; Manufacturer: Taiyo Yuden; ClassName: Interface
C24 = CAP: CAP CER 10UF 10V X5R 0402; Part Number: CL05A106MP8NUB8; Manufacturer: Samsung Electro-Mechanics; ClassName: Interface
D1 D4 = LED: LED ORANGE CLEAR CHIP SMD; Manufacturer: SunLED; Part Number: XZMOK53W-8
D2 D5 = LED: LED RED CLEAR CHIP SMD; Manufacturer: SunLED; Part Number: XZM2ACR53W-8
D3 D6 = LED: LED GREEN CLEAR CHIP SMD; Manufacturer: SunLED; Part Number: XZVG53W-8
D7 = LED_Red: LED HE RD 0603; Part Number: SM0603HCL; Manufacturer: Bivar; ClassName: Interface
J1 = CCSH-W10R-04TR-BK-A: JST 4 PIN SMT CONN; Manufacturer: JST; Part Number: CCSH-W10R-04TR-BK-A
J2 = ER-CON30HT-1: 30 PINS 0.5 PITCH SMD TOP CONTACT CONN; Manufacturer: EastRising Technology; Part Number: ER-CON30HT-1
J3 = TC2050-IDC-NL: CBL PLUG-OF-NAILS 10-PIN; Manufacturer: Tag-Connect LLC; Part Number: TC2050-IDC-NL
JP1 = SolderJumper_Single: Solder Jumper Single 0.5mm Pitch
R1-R4 R11 = RES: RES SMD 100 OHM 1% 1/16W 0402; Part Number: ERJ-2RKF1000X; Manufacturer: Panasonic; ClassName: USB to UART PHY
R5 R8 = RES: RES 0 OHM JUMPER 1/16W 0402; Part Number: CRCW04020000Z0EDC; Manufacturer: Vishay / Dale; ClassName: -
R6 R7 R9 R10 R14 R16 R17 = RES: RES SMD 10K OHM 1% 1/16W 0402; Part Number: CR0402-FX-1002GLF; Manufacturer: Bourns
  R6 R7 R14 R16 R17: ClassName: -
  R9 R10: ClassName: Interface
R12 R13 = RES: RES SMD 2.7K OHM 1% 1/10W 0402; Part Number: ERJ-2RKF2701X; Manufacturer: Panasonic
R15 = RES: RES 1K OHM 1% 1/16W 0402; Part Number: CR0402AFX-1001GLF; Manufacturer: Bourns; ClassName: -
R18 = RES: RES SMD 390K OHM 1% 1/16W 0402; Part Number: CR0402-FX-3903GLF; Manufacturer: Bourns Inc.; ClassName: Interface
S1-S4 = B3F-105X: SWITCH TACTILE SPST-NO 0.05A 24V; Manufacturer: Omron Electronics Inc-EMC Div; Part Number: B3F-105X
S5 = PEC11R-4xxxF-Sxxxx: ROTARY ENCODER MECHANICAL XXPPR; Manufacturer: Bourns; Part Number: PEC11R-4115F-S0018
S6 = KMR 2 Series: SWITCH TACTILE SPST-NO 0.01A 32V; Manufacturer: C&K; Part Number: KMR243GLFG
U1 U2 = IS31FL3193: IC LED DRIVER LINEAR 42MA 10DFN; Manufacturer: Lumissil Microsystems; Part Number: IS31FL3193-DLS2-TR
U3 = STM32G031FxP6: IC MCU 32BIT 64KB FLASH 20TSSOP; Manufacturer: STMicroelectronics; Part Number: STM32G031F8P6
Y1 = ASE-XXXXX-MHZ-X-X: OSC XO 10.000MHZ CMOS SMD; Manufacturer: Abracon; Part Number: ASE-10.000MHZ-LC-T; ClassName: Interface